# EAGLE design Grove - Temperature sensor v1.1 (EAGLE 6.4)
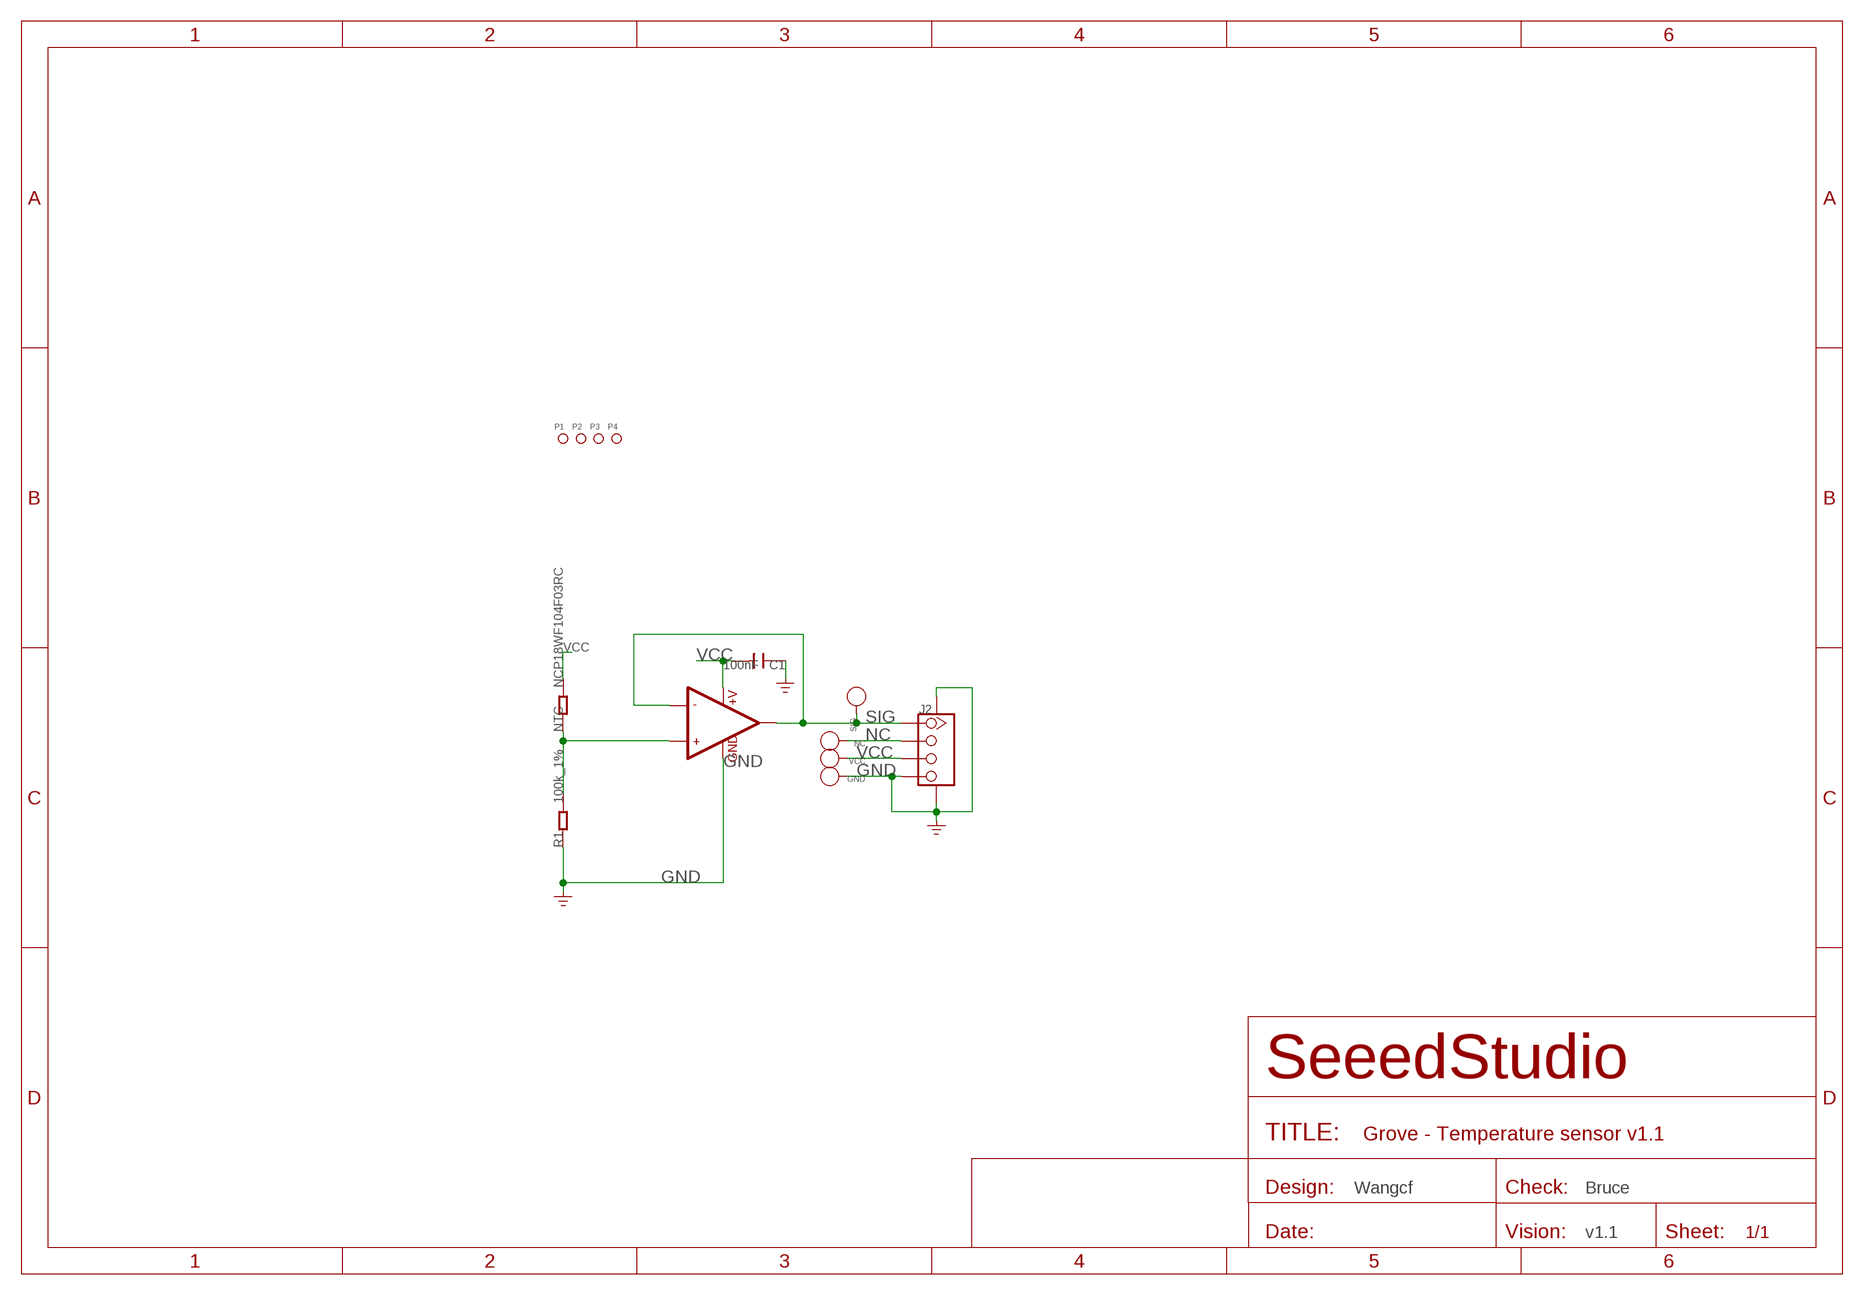
[diagram p0: schematic, sheet 1]

## Parts
C1  100nF  C-0603  [C0603]
GND  PAD-TEST-POINT'4545'  [TP_4545]
J2  TWIG-4P-2.0-SMD-FEMALE-REINFORCE'DD'  [4P-SMD-2.0]
NC  PAD-TEST-POINT'4545'  [TP_4545]
NTC  NCP18WF104F03RC  R-0603  [R0603]
P1  PAD-MARK  [ROUND-MARK-1.0]
P2  PAD-MARK  [ROUND-MARK-1.0]
P3  PAD-MARK  [ROUND-MARK-1.0]
P4  PAD-MARK  [ROUND-MARK-1.0]
R1  100k_1%  R-0603  [R0603]
SIG  PAD-TEST-POINT'4545'  [TP_4545]
U1  LM358DR  LMV358  [SO08]
VCC  PAD-TEST-POINT'4545'  [TP_4545]

## Nets
GND: C1.1 GND.T J2.4 J2.SS1 J2.SS2 R1.1 U1.4(GND)
N$3: NTC.1 R1.2 U1.3(+IN1)
NC: J2.2 NC.T
SIG: J2.1 SIG.T U1.1(OUT1) U1.2(-IN1)
VCC: C1.2 J2.3 NTC.2 U1.8(+V) VCC.T
Unconnected: U1.5(+IN2) U1.6(-IN2) U1.7(OUT2)

## Notes on the sheet
- Wangcf | Bruce
- v1.1

## Library data of the parts
C1 = Discrete:C*: Ceramic Capacitors
GND NC SIG VCC = Discrete:PAD-TEST-POINT; PARTNO: DNP
J2 = Connector :TWIG-4P-2.0-SMD-FEMALE-REINFORCE
NTC R1 = Discrete:R*
P1-P4 = Discrete:PAD-MARK; PARTNO: DNP
U1 = ICs_v54:LMV358

## Board
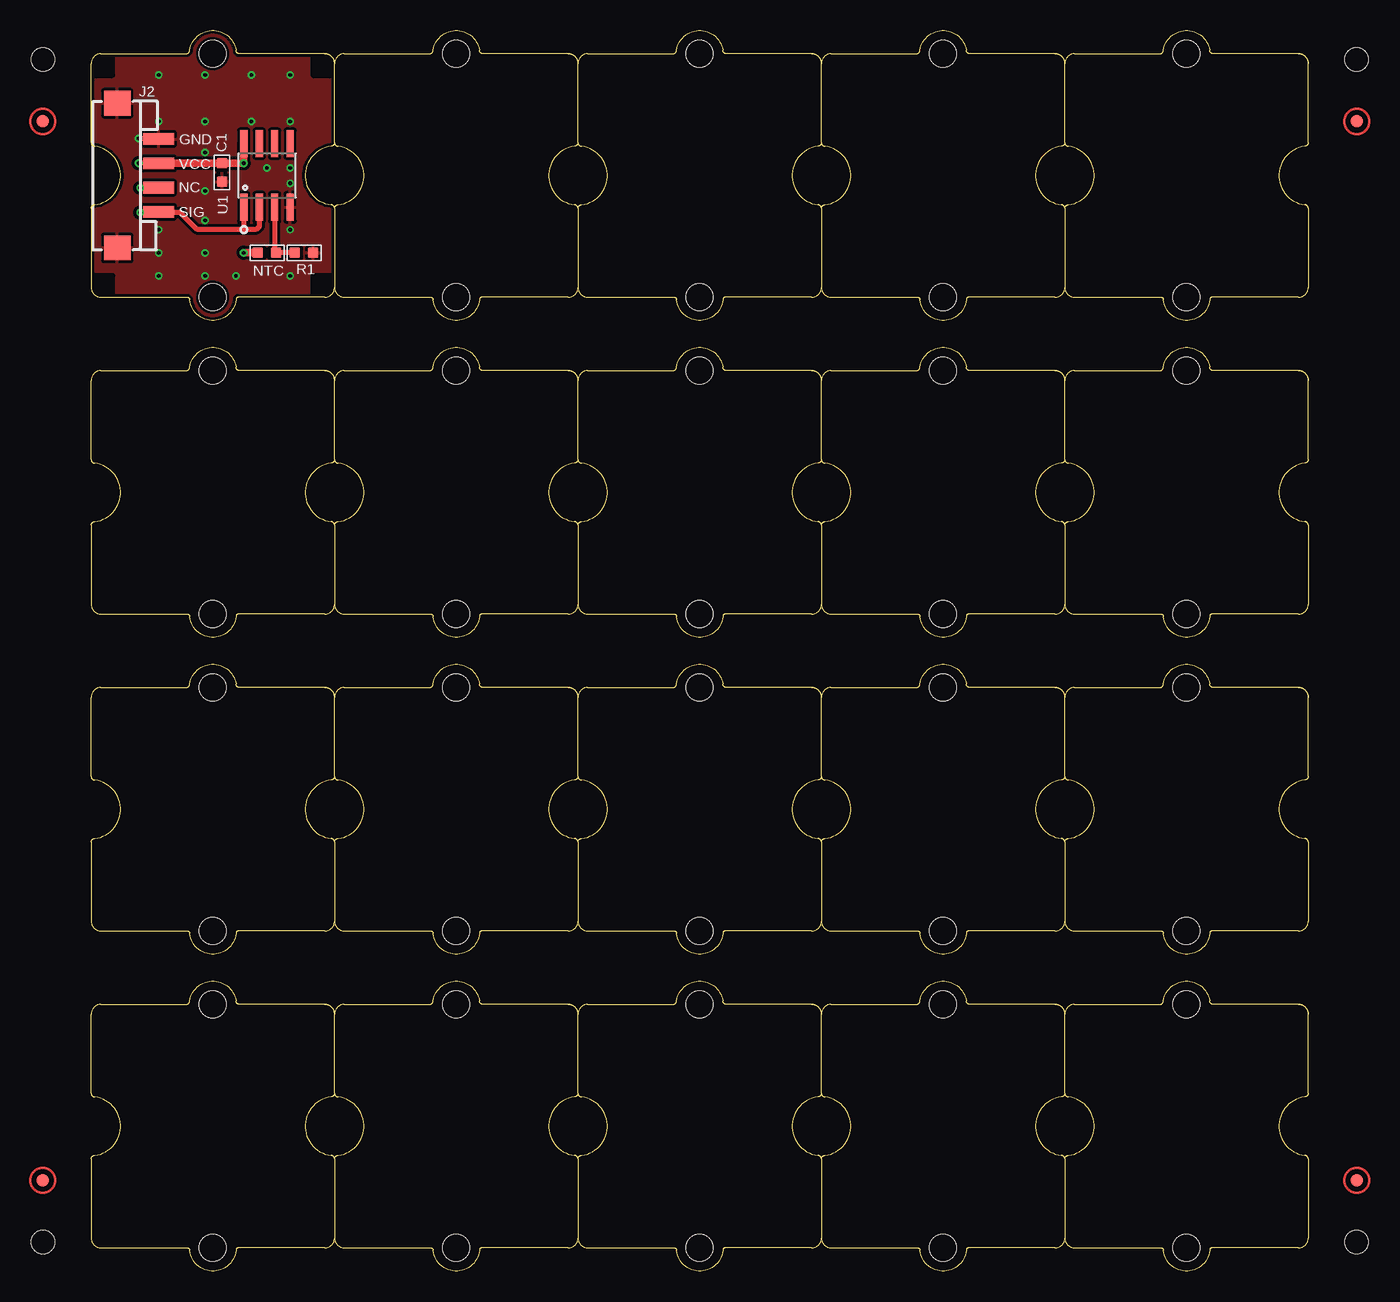
[diagram p1: board, top side]
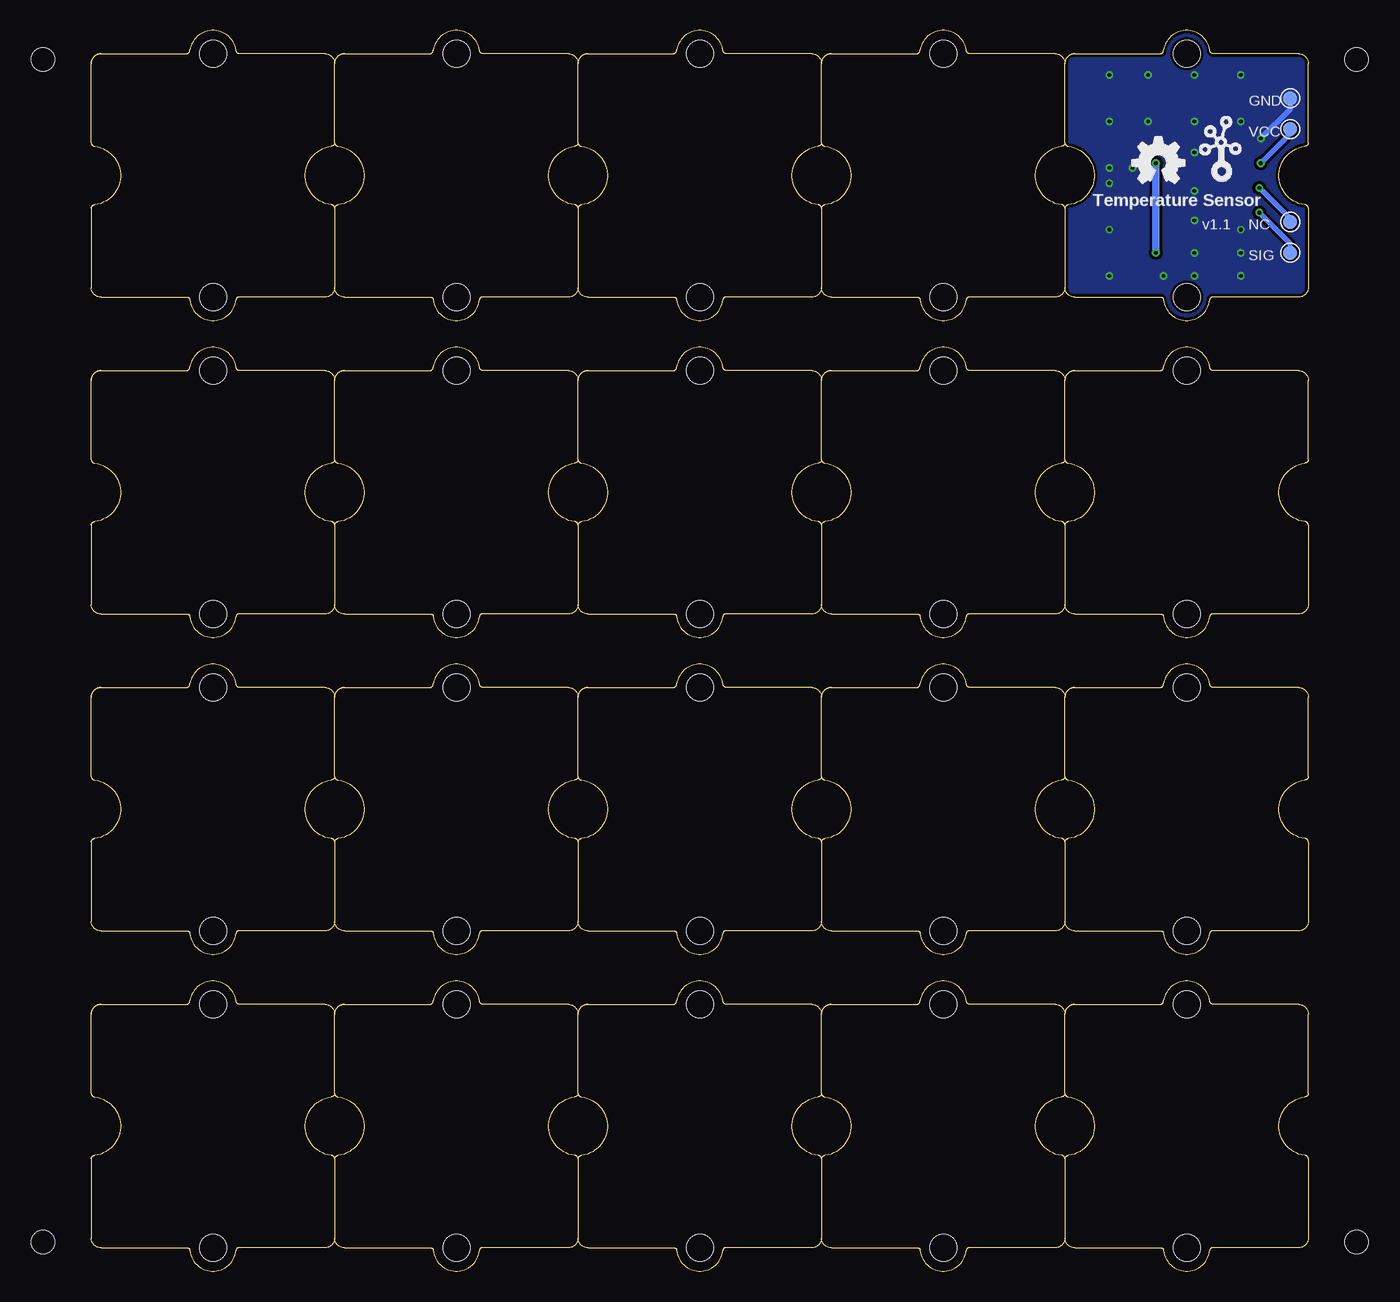
[diagram p2: board, bottom side, seen from below]

Size 100 x 101.93 mm. Coordinates in mm from the lower left corner, seen from the top.
Copper layers (1*16): Top 0.035mm / dielectric 1.5mm / Bottom 0.035mm
Design rules "SeeedStudio_rule_no_angle_090911 *": minimum track width 6mil, minimum drill 12mil, track to track 6mil, track to pad 6mil, pad to pad 6mil, via to via 6mil, smd to smd 0mil, copper to edge 10mil, drill to drill 10mil, minimum pad ring 10mil, minimum via ring 6mil, stop-mask expansion 2mil, vias tented up to drill 100mil, thermal gap 10mil
Holes 1.91 mm at -3.97,2.38 -3.97,99.54 103.98,99.54 103.98,2.38

### Footprints (pad centres in the part's own frame; a part is rotated, then mirrored left to right if it is on the bottom)
C0603 = smd 0.889 x 0.889: 1 -0.762,0; 2 0.762,0
TP_4545 = smd 1.143 x 1.143: T 0,0
4P-SMD-2.0 = smd 0.965 x 2.54: 1 -3,0; 2 -1,0; 3 1,0; 4 3,0 | smd 2.032 x 2.184: SS1 -5.946,3.4; SS2 5.946,3.4
R0603 = smd 0.889 x 0.889: 1 -0.762,0; 2 0.762,0
ROUND-MARK-1.0 = smd 1.016 x 1.016: P$1 0,0
SO08 = smd 0.61 x 2.21: 1 -1.905,-2.616; 2 -0.635,-2.616; 3 0.635,-2.616; 4 1.905,-2.616; 5 1.905,2.616; 6 0.635,2.616; 7 -0.635,2.616; 8 -1.905,2.616
1U-DIM-W/-DRILL = hole 2.2: 0,-10; 0,10

### Placement (x,y rotation side)
C1  10.76,90.27 90 top
GND  1.49,96.36 0 bottom
J2  5.55,90.01 90 top
NC  1.49,86.2 0 bottom
NTC  14.45,83.66 180 top
P1  -3.97,7.46 0 top  (outside the outline)
P2  103.98,7.46 0 top  (outside the outline)
P3  -3.97,94.46 0 top  (outside the outline)
P4  103.98,94.46 0 top  (outside the outline)
R1  17.49,83.66 180 top
SIG  1.49,83.66 0 bottom
U1  14.45,90.01 0 top
U$4  [1U-DIM-W/-DRILL]  10,90.01 0 top
U$6  [TWIGLOGO_SMALL]  9.37,89.38 0 bottom
U$7  [OSHW_FILLX150_NOTEXT]  14.45,89.38 0 bottom
U$10  [1U-DIM-W/-DRILL]  30,90.01 0 top
U$11  [1U-DIM-W/-DRILL]  50,90.01 0 top
U$12  [1U-DIM-W/-DRILL]  70,90.01 0 top
U$13  [1U-DIM-W/-DRILL]  90,90.01 0 top
U$14  [1U-DIM-W/-DRILL]  30,63.98 0 top
U$15  [1U-DIM-W/-DRILL]  50,63.98 0 top
U$16  [1U-DIM-W/-DRILL]  70,63.98 0 top
U$17  [1U-DIM-W/-DRILL]  90,63.98 0 top
U$18  [1U-DIM-W/-DRILL]  10,63.98 0 top
U$19  [1U-DIM-W/-DRILL]  30,37.94 0 top
U$20  [1U-DIM-W/-DRILL]  50,37.94 0 top
U$21  [1U-DIM-W/-DRILL]  70,37.94 0 top
U$22  [1U-DIM-W/-DRILL]  90,37.94 0 top
U$23  [1U-DIM-W/-DRILL]  10,37.94 0 top
U$24  [1U-DIM-W/-DRILL]  30,11.91 0 top
U$25  [1U-DIM-W/-DRILL]  50,11.91 0 top
U$26  [1U-DIM-W/-DRILL]  70,11.91 0 top
U$27  [1U-DIM-W/-DRILL]  90,11.91 0 top
U$28  [1U-DIM-W/-DRILL]  10,11.91 0 top
VCC  1.49,93.82 0 bottom

### Tracks (layer width: path | path; a pad name or v marks a point on that pad's centre or on a via)
GND  (via drill 0.3)
  Top 0.406: v3.9,93.06 5.51,93.06 J2.4
  Bottom 0.406: GND.T 1.49,95.47 v3.9,93.06
  other vias: 5.55,94.46 5.55,85.57 5.55,83.66 9.37,91.92 9.37,88.74 14.45,90.65 16.35,90.65 16.35,89.38 16.35,85.57 9.37,94.46 13.18,94.46 16.35,94.46 16.35,81.76 5.55,81.76 16.35,98.27 5.55,98.27 9.37,98.27 13.18,98.27 9.37,83.66 9.37,81.76 11.9,81.76 9.37,86.33
  pour Top (isolate 0.254): -0.03,102.08 20.16,102.08 20.16,77.95 -0.03,77.95
  pour Bottom (isolate 0.254): -0.16,102.08 20.03,102.08 20.03,77.95 -0.16,77.95
N$3
  Top 0.406: U1.3 15.08,83.79 NTC.1 R1.2
NC  (via drill 0.3)
  Top 0.406: v4.03,89 5.54,89 J2.2
  Bottom 0.406: NC.T 1.49,86.46 v4.03,89
SIG  (via drill 0.3)
  Top 0.406: U1.1 12.54,85.57 | U1.2 13.81,85.82 13.56,85.57 12.54,85.57 | 12.54,85.57 8.73,85.57 7.29,87.01 J2.1 5.51,86.97 v4.03,86.97
  Bottom 0.406: SIG.T 1.49,84.43 v4.03,86.97
VCC  (via drill 0.3 pad 0.64)
  Top 0.406: J2.3 3.92,91.01 v3.9,91.03
  Top 0.61: U1.8 v12.54,91.03 C1.2 10.75,91.01 J2.3 | v12.54,83.66 NTC.2
  Bottom 0.203: 1.49,93.44 VCC.T
  Bottom 0.406: v3.9,91.03 1.49,93.44
  Bottom 0.61: v12.54,91.03 v12.54,83.66

### Text on the board
tPlace: GND | VCC | NC | SIG
bPlace: Temperature Sensor | v1.1